# EasyEDA Pro project MAX5864_REUSE.eprj, schematic Schematic2
Create Date: 2024-11-02; Page Name: P1; Project Name: MAX5864_REUSE; Schematic Name: Schematic2; Update Date: 2024-11-02; Company: EasyEDA.com; Drawn: EasyEDA; Page Size: A4; Part Number: JLCPCB-002; Reviewed: EasyEDA; Version: V0.1
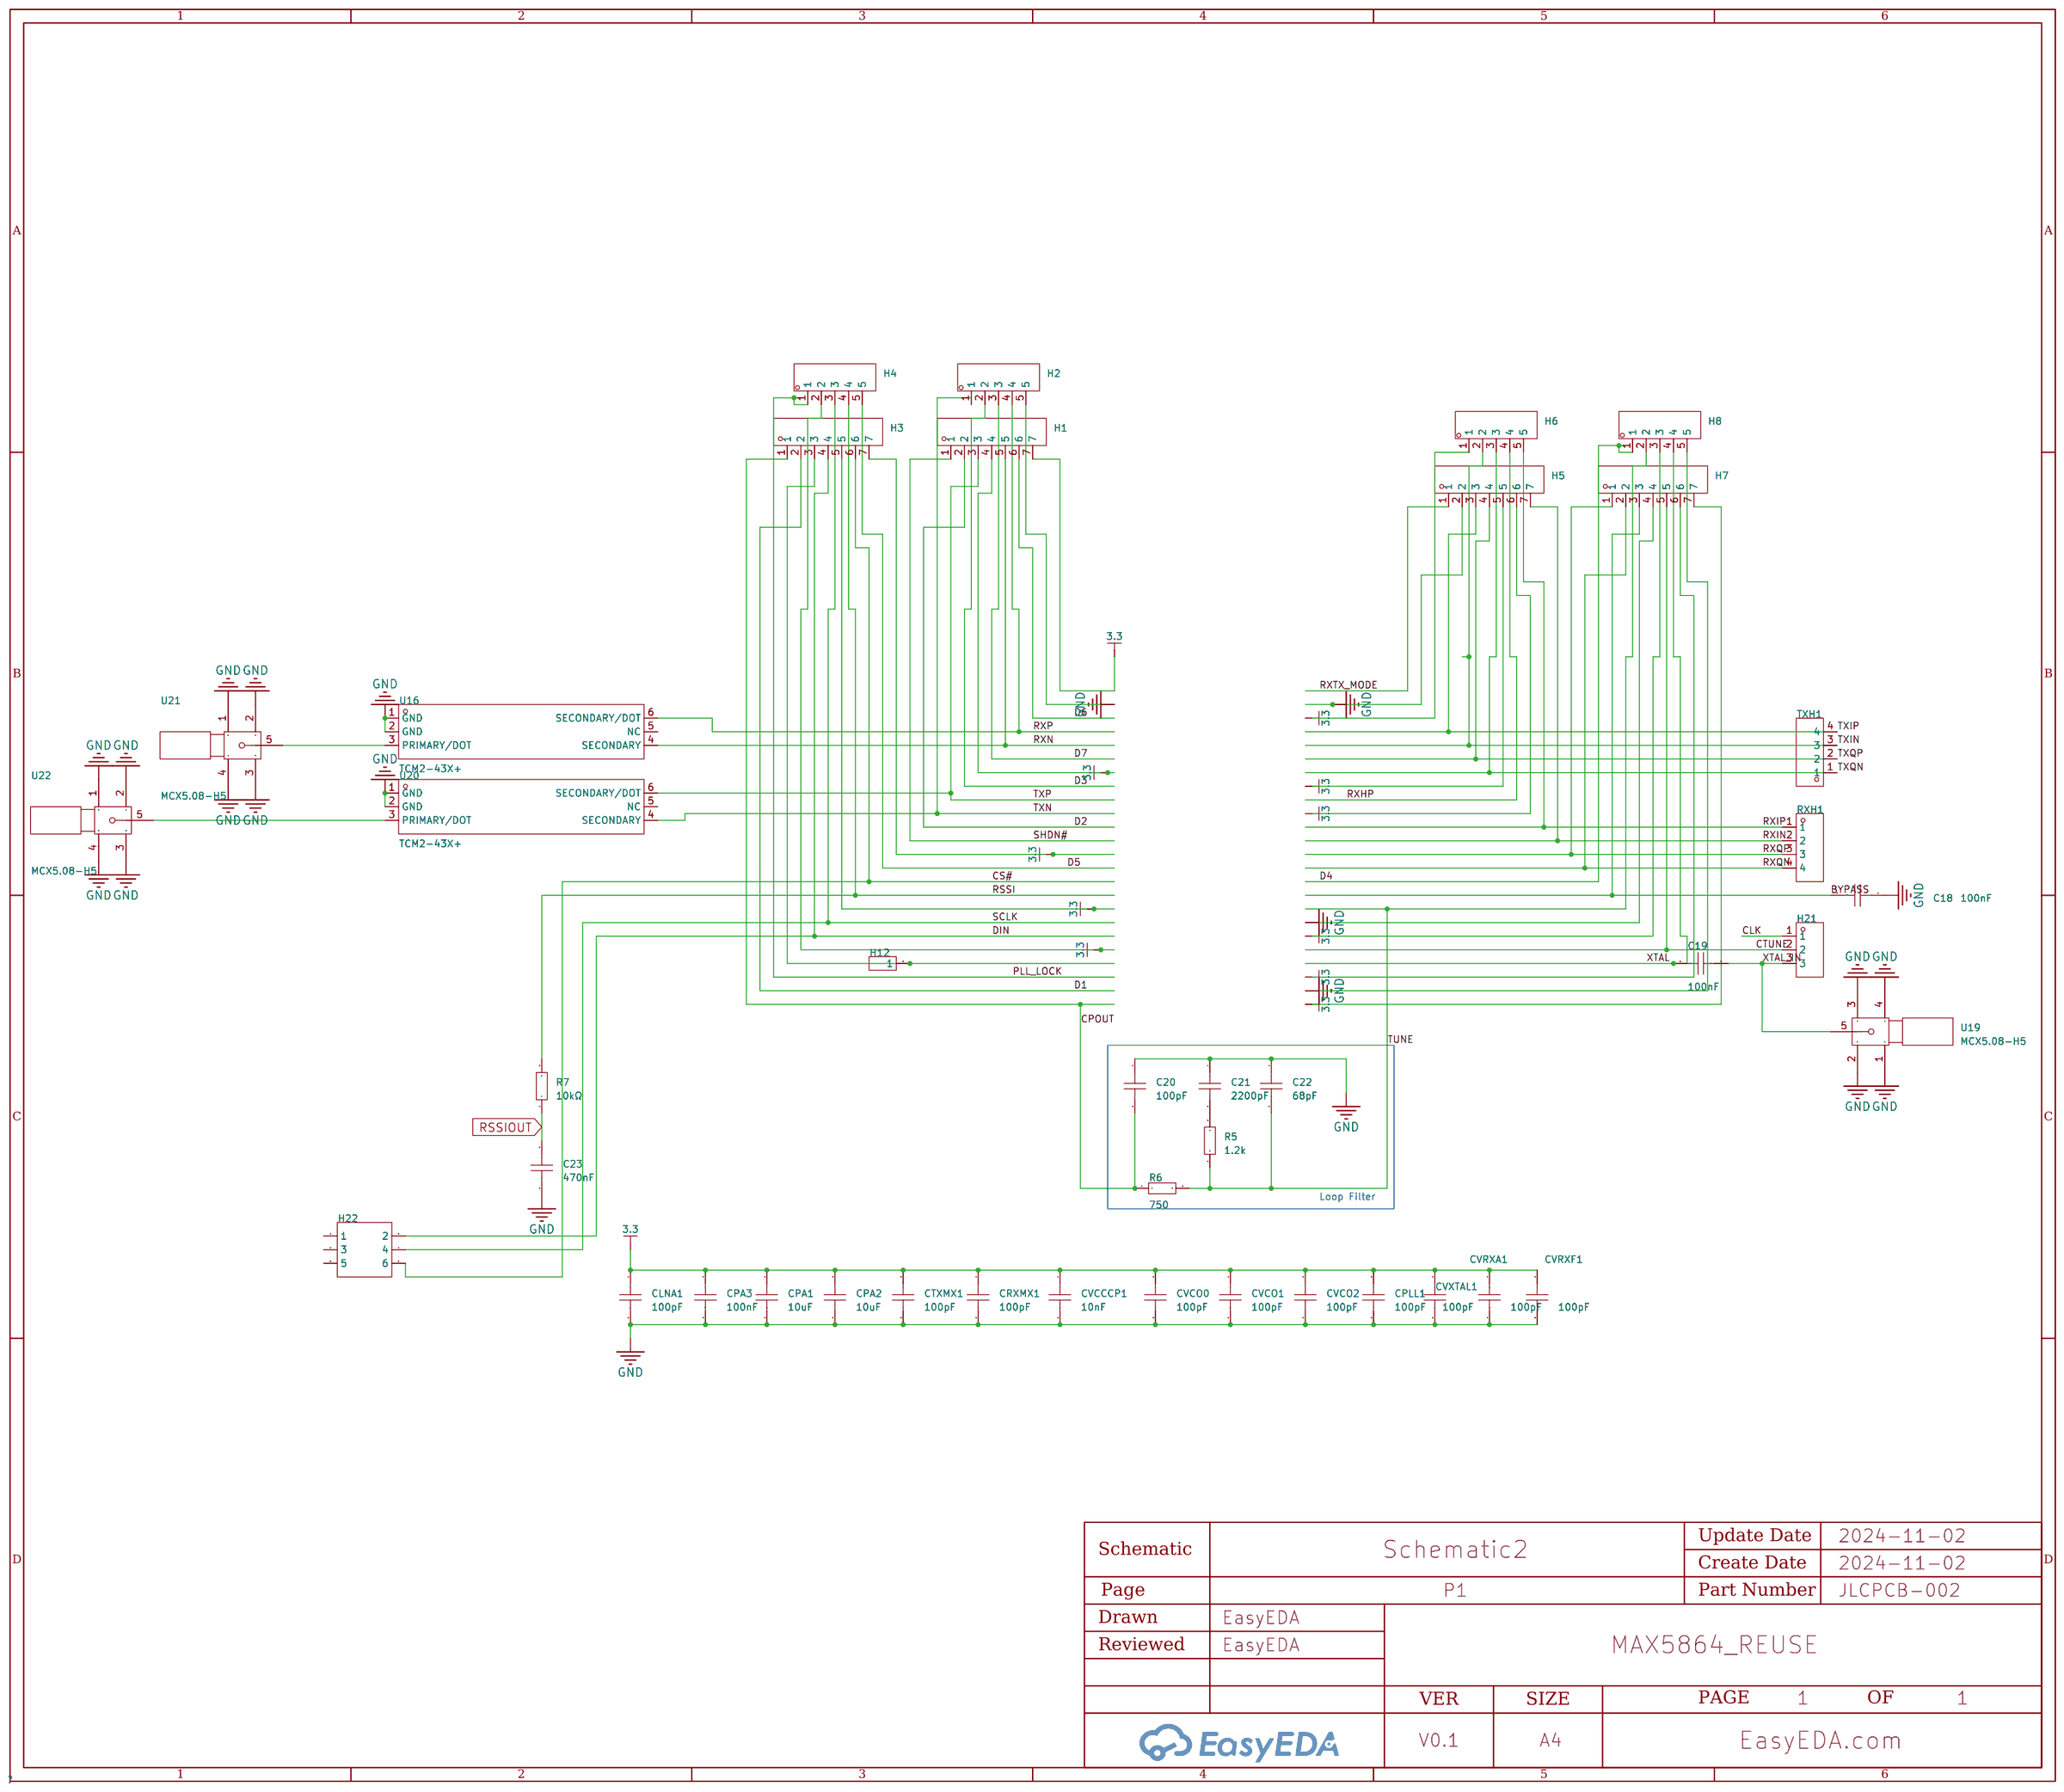
[diagram p1: schematic sheet]

## Parts
C18  100nF  [C0603]
C19  100nF  [C0603]
C20  100pF  [C0603]
C21  2200pF  [C0603]
C22  68pF  [C0603]
C23  470nF  [CAP-TH_L7.2-W2.5-P5.00-D0.5]
CLNA1  100pF  [C0603]
CPA1  10uF  [C0603]
CPA2  10uF  [C0603]
CPA3  100nF  [C0603]
CPLL1  100pF  [C0603]
CRXMX1  100pF  [C0603]
CTXMX1  100pF  [C0603]
CVCCCP1  10nF  [C0603]
CVCO0  100pF  [C0603]
CVCO1  100pF  [C0603]
CVCO2  100pF  [C0603]
CVRXA1  100pF  [C0603]
CVRXF1  100pF  [C0603]
CVXTAL1  100pF  [C0603]
H1  -  [HDR-TH_7P-P2.54-V-M]
H2  -  [HDR-TH_5P-P2.54-V-M]
H3  -  [HDR-TH_7P-P2.54-V-M]
H4  -  [HDR-TH_5P-P2.54-V-M]
H5  -  [HDR-TH_7P-P2.54-V-M]
H6  -  [HDR-TH_5P-P2.54-V-M]
H7  -  [HDR-TH_7P-P2.54-V-M]
H8  -  [HDR-TH_5P-P2.54-V-M]
H12  -  [HDR-TH_1P-V-M_XKB_X4611WV-01I-C28D40]
H21  -  [HDR-TH_3P-P2.54-V-M]
H22  -  [HDR-TH_6P-P2.54-V-F-R2-C3-S2.54]
R5  1.2k  [R0603]
R6  750  [R0603]
R7  10kΩ  [R_AXIAL-0.4]
RXH1  -  [HDR-TH_4P-P2.54-V-M]
TXH1  -  [HDR-TH_4P-P2.54-V-M]
U16  TCM2-43X+  [IND-SMD_6P-L4.1-W3.8-P1.27-TL]
U19  MCX5.08-H5  [SMA-TH_MCX5.08-H5]
U20  TCM2-43X+  [IND-SMD_6P-L4.1-W3.8-P1.27-TL]
U21  MCX5.08-H5  [SMA-TH_MCX5.08-H5]
U22  MCX5.08-H5  [SMA-TH_MCX5.08-H5]

## Library data of the parts
C18-C22 CLNA1 CPA1-CPA3 CPLL1 CRXMX1 CTXMX1 CVCCCP1 CVCO0-CVCO2 CVRXA1 CVRXF1 CVXTAL1 = CAP_0603: Supplier Footprint: 0603
C23 = C241J474J20C000: Capacitance:470nF Tolerance:±5% Tolerance:±5% Voltage Rated: Dielectric Material:Metallized Polyester Film Capacitor Operating Temperature:-55℃~+125℃ Operating Temperature:-55℃~+125℃; LCSC Part Name: 470nF ±5% 63V; Supplier Part: C5121927; Manufacturer: faratronic(厦门法拉); Supplier Footprint: 插件,P=5mm; JLCPCB Part Class: Extended Part; Datasheet: https://atta.szlcsc.com/upload/public/pdf/source/20220309/53E9D6585E584592026F1B9FCED89B93.pdf; Supplier: LCSC; Tolerance: ±5%; Dielectric Material: Metallized Polyester Film Capacitor; Operating Temperature: -55℃~+125℃
H1 H3 H5 H7 = HDR-M_2.54_1x7P: Supplier Footprint: Through
H2 H4 H6 H8 = HDR-M_2.54_1x5P: Supplier Footprint: Through
H12 = HDR-M_2.54_1x1P: Supplier Footprint: Through
H21 = HDR-M_2.54_1x3P: Supplier Footprint: Through
H22 = HDR-F-2.54_2x3: Supplier Footprint: Through
R5 R6 = Res_0603: Supplier Footprint: 0603
R7 = Res_AXIAL-1/4W: Supplier Footprint: Through
RXH1 TXH1 = HDR-M_2.54_1x4P: Supplier Footprint: Through
U16 U20 = TCM2-43X+: Frequency Range:10MHz~4GHz Frequency Range:10MHz~4GHz Impedance Ratio-Unbalanced/Balanced:1:2 Insertion Loss (Max):3dB Phase Balance:7° Return Loss (Min):14.98dB; LCSC Part Name: 射频变压器; Supplier Part: C2885644; Manufacturer: Mini-Circuits; Supplier Footprint: SMD-6P; JLCPCB Part Class: Extended Part; Datasheet: https://atta.szlcsc.com/upload/public/pdf/source/20210825/C2885644_24D8D5254C12C7AF6CFE8387515C0B6D.pdf; Supplier: LCSC; Frequency Range: 10MHz~4GHz; Impedance Ratio-Unbalanced/Balanced: 1:2; Insertion Loss (Max): 3dB; Phase Balance: 7°; Return Loss (Min): 14.98dB
U19 U21 U22 = MCX5.08-H5_C9900009324: Supplier Part: C9900009324; Supplier Footprint: COAX-F; JLCPCB Part Class: Extended Part; Supplier: LCSC

## Nets
GND: C18.1 C20.1 C21.1 C22.1 C23.1 CLNA1.2 CPA1.2 CPA2.2 CPA3.2 CPLL1.2 CRXMX1.2 CTXMX1.2 CVCCCP1.2 CVCO0.2 CVCO1.2 CVCO2.2 CVRXA1.2 CVRXF1.2 CVXTAL1.2 H2.5 H5.2 H7.4 H8.5 U16.1(GND) U16.2(GND) U19.1 U19.2 U19.3 U19.4 U20.1(GND) U20.2(GND) U21.1 U21.2 U21.3 U21.4 U22.1 U22.2 U22.3 U22.4
3.3: CLNA1.1 CPA1.1 CPA2.1 CPA3.1 CPLL1.1 CRXMX1.1 CTXMX1.1 CVCCCP1.1 CVCO0.1 CVCO1.1 CVCO2.1 CVRXA1.1 CVRXF1.1 CVXTAL1.1 H1.4 H1.7 H3.5 H3.7 H4.2 H5.5 H5.6 H6.1 H7.6 H7.7 H8.3
BYPASS: C18.2 H7.3
CLK: H21.1
CPOUT: C20.2 H3.1 R6.1
CS#: H3.6 H22.6
CTUNE: H7.5 H21.2
D1: H3.2
D2: H1.2
D3: H2.2
D4: H8.1
D5: H4.5
D6: H1.6
D7: H2.3
DIN: H3.4 H22.2
PLL_LOCK: H4.1
RSSI: H4.4 R7.2
RSSIOUT: C23.2 R7.1
RXHP: H6.4
RXIN: H5.7 RXH1.2
RXIP: H6.5 RXH1.1
RXN: H1.5 U16.4(SECONDARY)
RXP: H2.4 U16.6(SECONDARY/DOT)
RXQN: H7.2 RXH1.4
RXQP: H7.1 RXH1.3
RXTX_MODE: H5.1
SCLK: H4.3 H22.4
SHDN#: H1.1
TUNE: C22.2 H8.2 R5.2 R6.2
TXIN: H6.2 TXH1.3
TXIP: H5.3 TXH1.4
TXN: H2.1 U20.4(SECONDARY)
TXP: H1.3 U20.6(SECONDARY/DOT)
TXQN: H6.3 TXH1.1
TXQP: H5.4 TXH1.2
XTAL: C19.2 H8.4
XTAL_IN: C19.1 H21.3 U19.5
$1N5448: C21.2 R5.1
$1N7403: H3.3 H12.1
$1N9841: U20.3(PRIMARY/DOT) U22.5
$1N9844: U16.3(PRIMARY/DOT) U21.5

Not connected (* = marked no-connect by the designer): H22 1 3 5; U16 5(NC); U20 5(NC)

## Notes on the sheet
- Loop Filter
